# Altium schematic sheet Cover page.SchDoc: Cover page
size A3; Date: 13/11/2025; DrawnBy: Văn Quý Tuân; Revision: 1; SheetNumber: 1; SheetTotal: 12; Size: A3; Subsystem: HW_11.11.2025
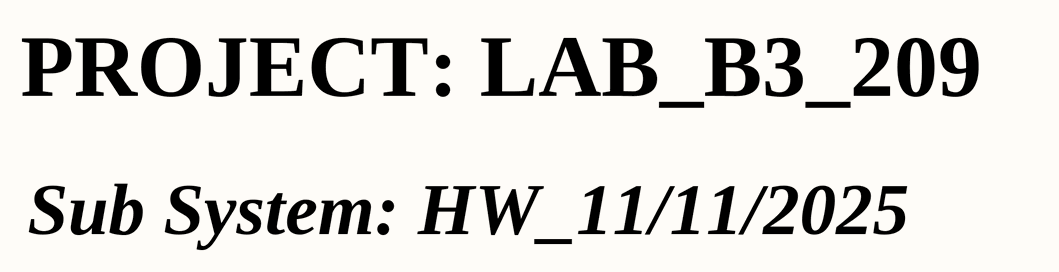
[diagram p0: Cover page.SchDoc]

## Notes on the sheet
- PROJECT: LAB_B3_209
- Sub System: HW_11/11/2025
- Project:
- Sub-system:
- Checked by:
- Design by:
- Sheet title:
- Doc no:
- Sheet
- Size
- Approved by:
- Revision:
- Date
- Text